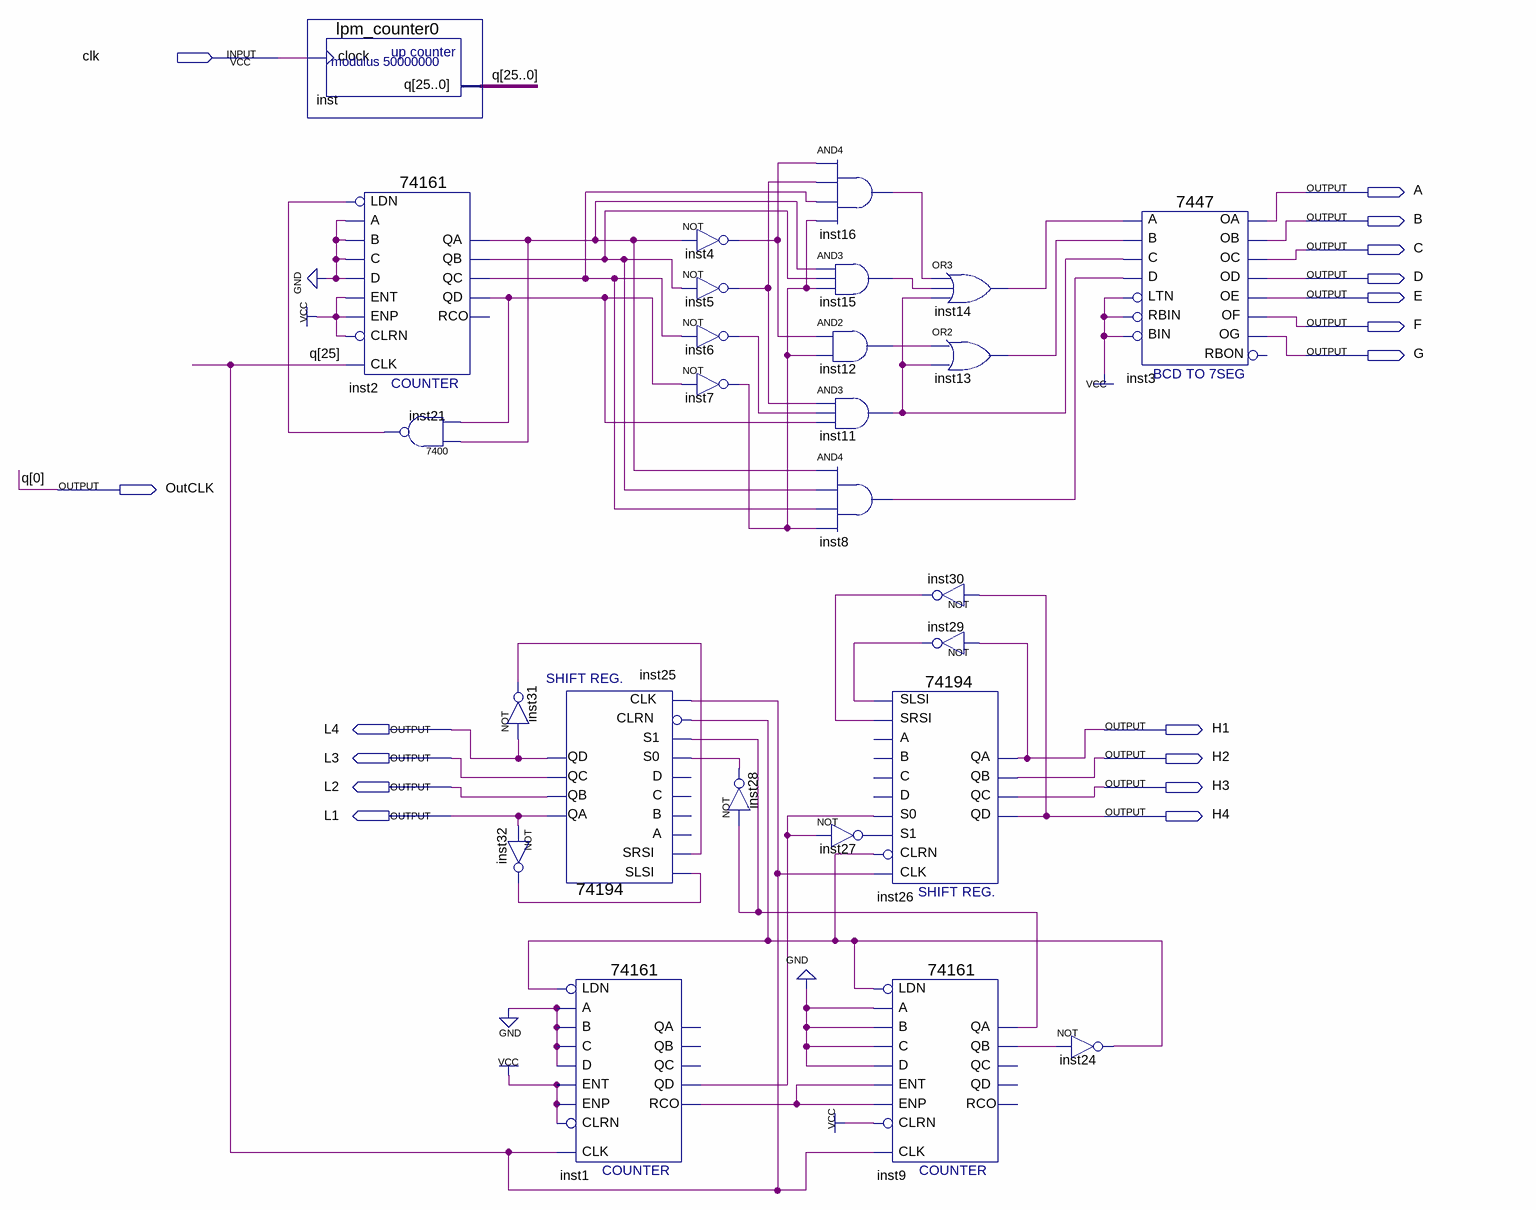
[diagram p0: schematic sheet]
// Quartus schematic iddisplay_1.bdf as structural Verilog: 26 symbols, 17 pins
module iddisplay_1 (
  input  clk,
  output A,
  output B,
  output C,
  output D,
  output E,
  output F,
  output G,
  output OutCLK,
  output L4,
  output H1,
  output L3,
  output H2,
  output L2,
  output H3,
  output L1,
  output H4
);

  wire inst1_qd, inst1_rco, inst2_qa, inst2_qb, inst2_qc, inst2_qd, inst4_out, inst5_out, inst6_out,
       inst7_out, inst8_out, inst9_qa, inst9_qb, inst11_out, inst12_out, inst13_out, inst14_out, inst15_out,
       inst16_out, inst21_1, inst24_out, inst27_out, inst28_out, inst29_out, inst30_out, inst31_out,
       inst32_out;
  wire [25:1] q;

  lpm_counter0 inst (.clock(clk), .q({q, OutCLK}));
  \74161  inst2 (
    .CLRN(1'b1), .CLK(q[25]), .ENP(1'b1), .LDN(inst21_1), .A(1'b0), .D(1'b0), .ENT(1'b1), .B(1'b0), .C(1'b0),
    .QD(inst2_qd), .QC(inst2_qc), .QB(inst2_qb), .QA(inst2_qa));  // open: RCO
  \7400  inst21 (.\3 (inst2_qd), .\2 (inst2_qa), .\1 (inst21_1));
  not inst31 (inst31_out, L4);
  not inst32 (inst32_out, L1);
  \74194  inst25 (
    .SLSI(inst32_out), .SRSI(inst31_out), .CLK(q[25]), .CLRN(inst24_out), .S1(inst9_qa), .S0(inst28_out),
    .QA(L1), .QB(L2), .QC(L3), .QD(L4));  // open: B, C, D, A
  \74161  inst1 (
    .CLRN(1'b1), .CLK(q[25]), .ENP(1'b1), .LDN(inst24_out), .A(1'b0), .D(1'b0), .ENT(1'b1), .B(1'b0),
    .C(1'b0), .QD(inst1_qd), .RCO(inst1_rco));  // open: QC, QB, QA
  not inst4 (inst4_out, inst2_qa);
  not inst5 (inst5_out, inst2_qb);
  not inst6 (inst6_out, inst2_qc);
  not inst7 (inst7_out, inst2_qd);
  not inst28 (inst28_out, inst9_qa);
  and inst16 (inst16_out, inst4_out, inst5_out, inst2_qc, inst7_out);
  and inst15 (inst15_out, inst2_qa, inst2_qb, inst7_out);
  and inst12 (inst12_out, inst4_out, inst7_out);
  and inst11 (inst11_out, inst5_out, inst6_out, inst2_qd);
  and inst8 (inst8_out, inst2_qa, inst2_qb, inst2_qc, inst7_out);
  \74194  inst26 (
    .SLSI(inst29_out), .SRSI(inst30_out), .CLK(q[25]), .CLRN(inst24_out), .S1(inst27_out), .S0(inst1_qd),
    .QA(H1), .QB(H2), .QC(H3), .QD(H4));  // open: B, C, D, A
  not inst27 (inst27_out, inst1_qd);
  \74161  inst9 (
    .CLRN(1'b1), .CLK(q[25]), .ENP(inst1_rco), .LDN(inst24_out), .A(1'b0), .D(1'b0), .ENT(inst1_rco),
    .B(1'b0), .C(1'b0), .QB(inst9_qb), .QA(inst9_qa));  // open: QD, QC, RCO
  or inst14 (inst14_out, inst16_out, inst15_out, inst11_out);
  or inst13 (inst13_out, inst12_out, inst11_out);
  not inst30 (inst30_out, H4);
  not inst29 (inst29_out, H1);
  not inst24 (inst24_out, inst9_qb);
  \7447  inst3 (
    .LTN(1'b1), .B(inst13_out), .C(inst11_out), .D(inst8_out), .RBIN(1'b1), .BIN(1'b1), .A(inst14_out),
    .OB(B), .OC(C), .OE(E), .OD(D), .OF(F), .OG(G), .OA(A));  // open: RBON

  // Other names for the same wires on the sheet: q[0] = OutCLK
endmodule
